# Altium schematic sheet interlock_circuit.SchDoc: foxBMS BMS-Master
size A3; DocumentNumber: 15; SheetNumber: 15; SheetTotal: 24; Author: Fraunhofer IISB foxBMS Team; REL-DATE: 2017-05-16; VERSION: 1.0.2; SheetDescription: Interlock Circuit
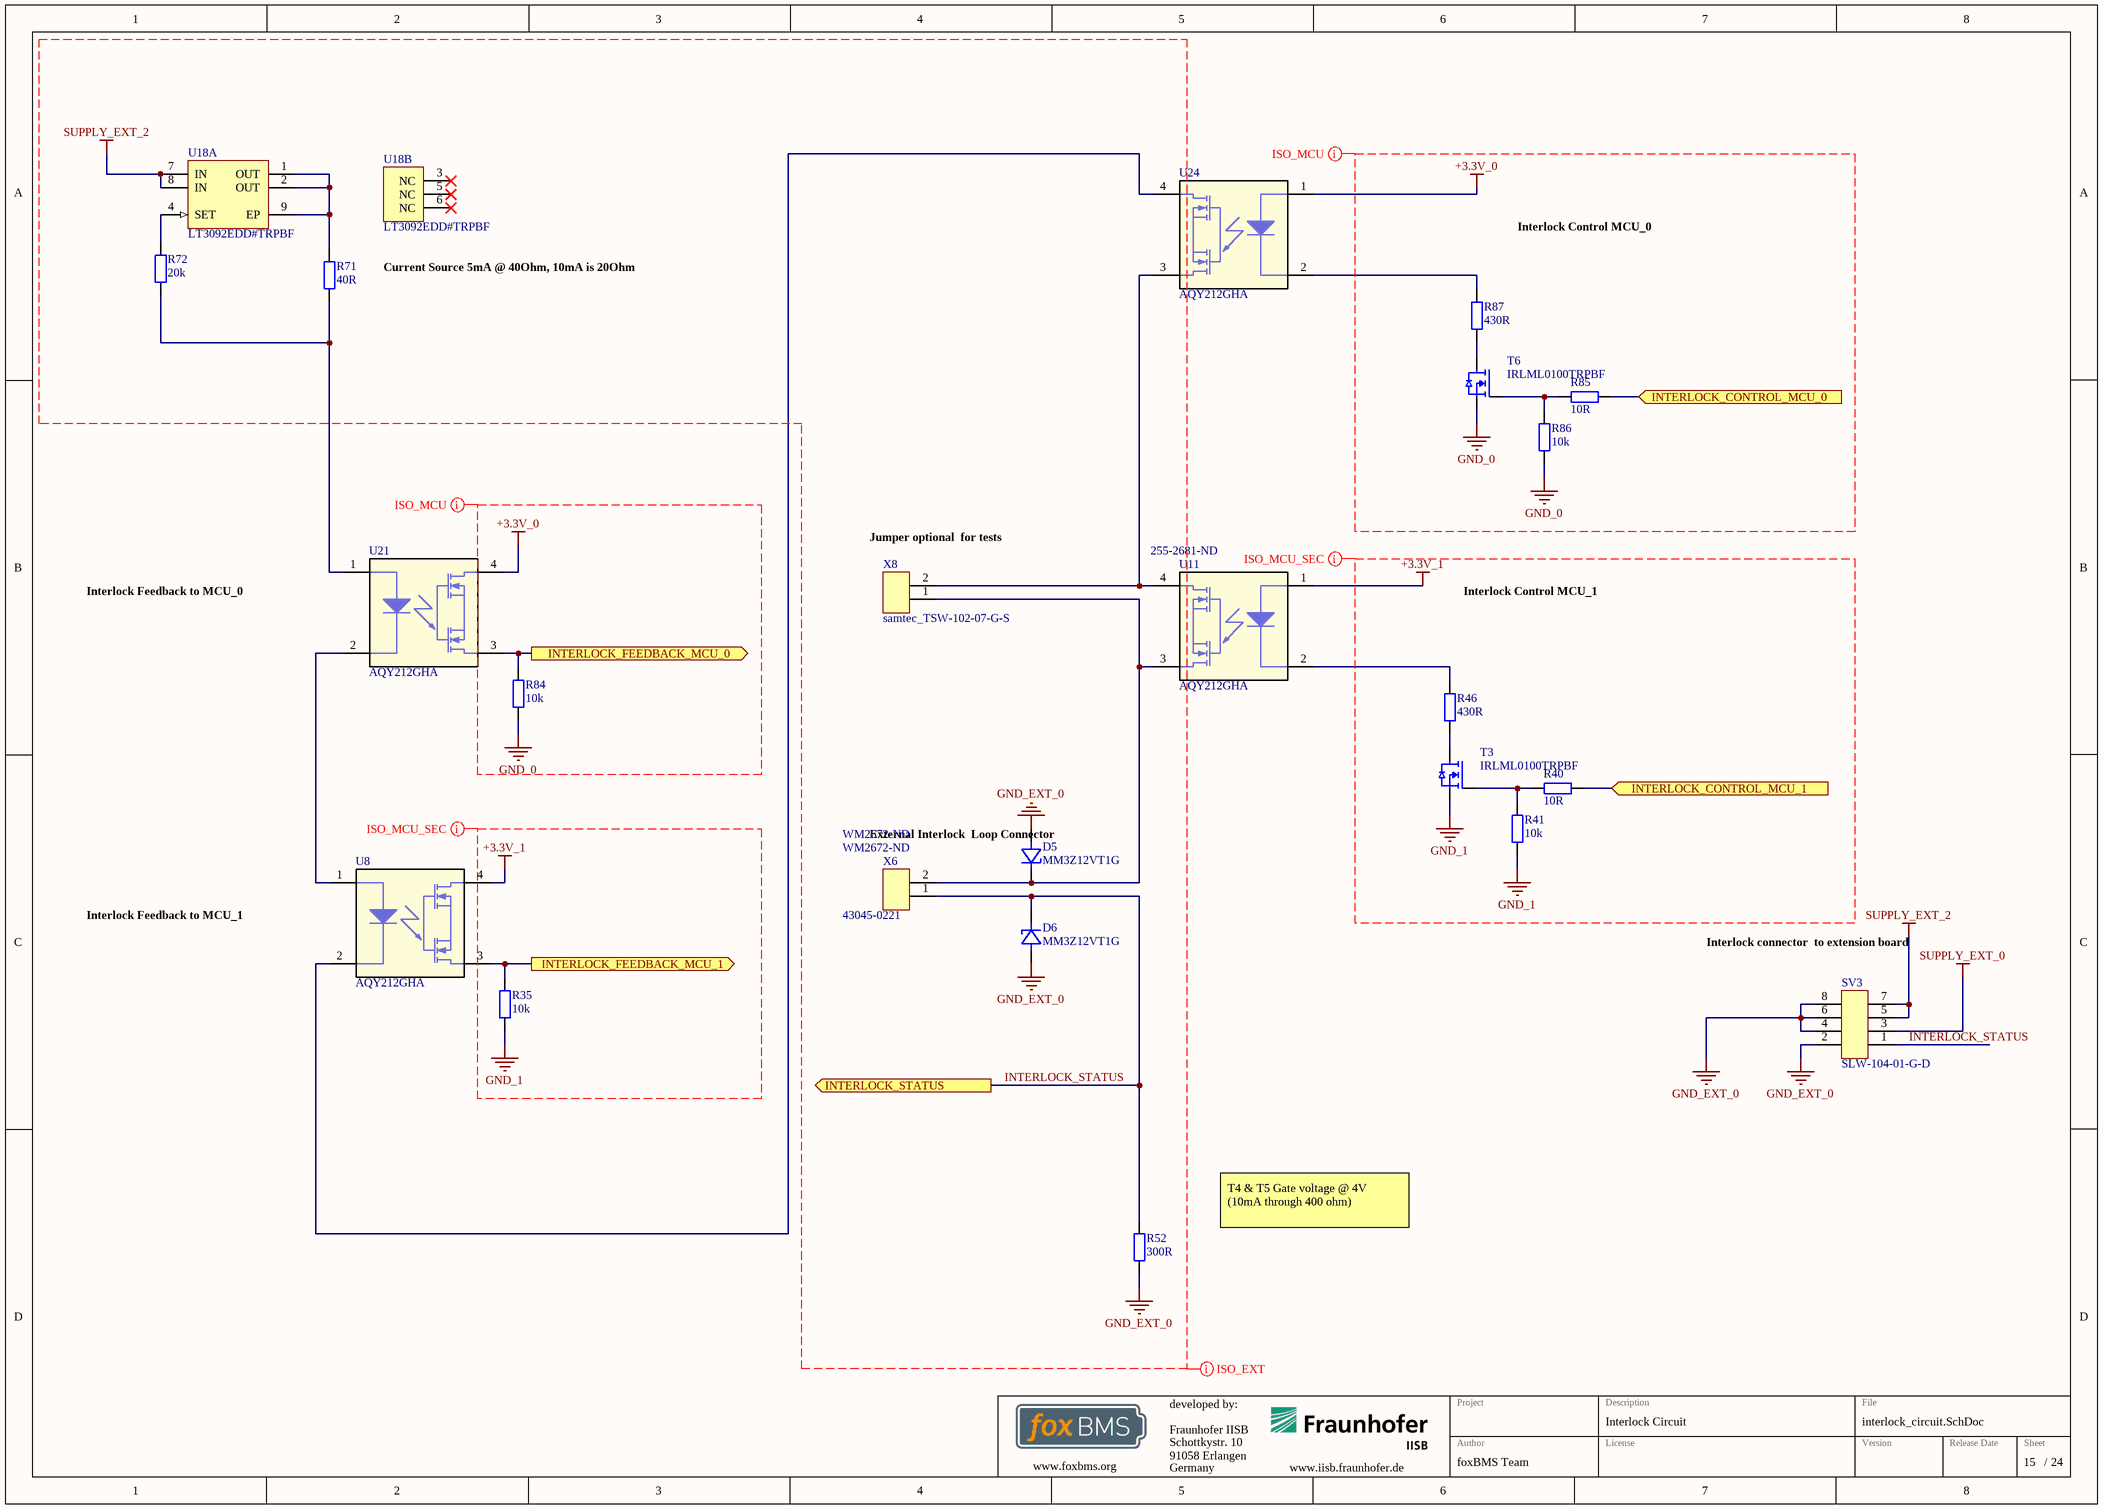
[diagram p0: interlock_circuit.SchDoc]

## Parts
D5  MM3Z12VT1G  [SODFL250X110-2N]
D6  MM3Z12VT1G  [SODFL250X110-2N]
R35  10k  [0603R]
R40  10R  [0603R]
R41  10k  [0603R]
R46  430R  [0603R]
R52  300R  [0805R]
R71  40R  [0805R]
R72  20k  [0805R]
R84  10k  [0603R]
R85  10R  [0603R]
R86  10k  [0603R]
R87  430R  [0603R]
SV3  SLW-104-01-G-D  [SLW_104_01_G_D]
T3  IRLML0100TRPBF  [SOT95P237X110-3N]
T6  IRLML0100TRPBF  [SOT95P237X110-3N]
U8  AQY212GHA  [PAN_AQY21-SO4]
U11  AQY212GHA  Supplier Part Number 1: 255-2681-ND  [PAN_AQY21-SO4]
U18  LT3092EDD#TRPBF  [LT-DD-8_V]  (parts A,B of 2)
U21  AQY212GHA  [PAN_AQY21-SO4]
U24  AQY212GHA  [PAN_AQY21-SO4]
X6  43045-0221  Supplier Part Number 1: WM2672-ND  [43045-0221]
X8  samtec_TSW-102-07-G-S  [Pinheader_2.54_2]

## Ports
INTERLOCK_CONTROL_MCU_0 (in), INTERLOCK_CONTROL_MCU_1 (in), INTERLOCK_FEEDBACK_MCU_0 (out), INTERLOCK_FEEDBACK_MCU_1 (out), INTERLOCK_STATUS (out)

## Nets
+3.3V_0: U21.4 U24.1
+3.3V_1: U8.4 U11.1
GND_0: R84.1 R86.2 T6.S
GND_1: R35.1 R41.2 T3.S
GND_EXT_0: D5.2(A) D6.2(A) R52.1 SV3.2 SV3.4 SV3.6 SV3.8
SUPPLY_EXT_0: SV3.3
SUPPLY_EXT_2: SV3.5 SV3.7 U18.7(IN) U18.8(IN)
INTERLOCK_CONTROL_MCU_0: R85.2 ; port INTERLOCK_CONTROL_MCU_0
INTERLOCK_CONTROL_MCU_1: R40.2 ; port INTERLOCK_CONTROL_MCU_1
INTERLOCK_FEEDBACK_MCU_0: R84.2 U21.3 ; port INTERLOCK_FEEDBACK_MCU_0
INTERLOCK_FEEDBACK_MCU_1: R35.2 U8.3 ; port INTERLOCK_FEEDBACK_MCU_1
INTERLOCK_STATUS: D6.1(K) R52.2 SV3.1 X6.1 ; port INTERLOCK_STATUS
NetD5_1: D5.1(K) U11.3 X6.2 X8.1
NetR40_1: R40.1 R41.1 T3.G
NetR46_1: R46.1 T3.D
NetR46_2: R46.2 U11.2
NetR71_1: R71.1 R72.1 U21.1
NetR71_2: R71.2 U18.1(OUT) U18.2(OUT) U18.9(EP)
NetR72_2: R72.2 U18.4(SET)
NetR85_1: R85.1 R86.1 T6.G
NetR87_1: R87.1 T6.D
NetR87_2: R87.2 U24.2
NetU8_1: U8.1 U21.2
NetU8_2: U8.2 U24.4
NetU11_4: U11.4 U24.3 X8.2

Not connected (* = marked no-connect by the designer): U18 3(NC)* 5(NC)* 6(NC)*

## Layout directives
net class ISO_MCU: +3.3V_0, GND_0
net class ISO_MCU_SEC: +3.3V_1, GND_1
net class ISO_EXT: GND_EXT_0, INTERLOCK_STATUS, SUPPLY_EXT_2

## Notes on the sheet
- Interlock Control MCU_0
- Current Source 5mA @ 40Ohm, 10mA is 20Ohm
- (near X8) Jumper optional
  for tests
- Interlock Feedback to MCU_0
- Interlock Control MCU_1
- (near D5) External Interlock
  Loop Connector
- Interlock Feedback to MCU_1
- Interlock connector
  to extension board
- T4 & T5 Gate voltage @ 4V (10mA through 400 ohm)
- Fraunhofer IISB
- Schottkystr. 10
- developed by:
- 91058 Erlangen
- Germany
- Author
- Project
- License
- Description
- File
- Version
- Release Date
- Sheet
- www.foxbms.org
- www.iisb.fraunhofer.de
- foxBMS Team
- /

## Library data of the parts
D5 D6 = MM3Z12VT1G: Zener Diode; Manufacturer: ON Semiconductor; Breakdown Voltage: 12V; PnP Package: SOD323; Automotive Qualified: True; Part Number: MM3Z12VT1G; Part Name: MM3Z12VT1G; Operating Temperature: *; Continuous Forward Current: *; ComponentLink1Description: Datasheet; ComponentLink1URL: http://www.farnell.com/datasheets/1876691.pdf; Supplier 1: Farnell; Supplier Part Number 1: 1431191; Supplier 2: Digikey; Supplier Part Number 2: MM3Z12VT1GOSCT-ND; Supplier 3: Mouser; Supplier Part Number 3: 863-MM3Z12VT1G
R35 R41 R84 R86 = gen_R_10k_0603: SMD Resistor 10k 0603; Tolerance: 1%; Power: 0.1W; Case EIA: 0603; Case Metric: 1608; Maximum Working Voltage: 75V; PnP Package: R_0603; Automotive Qualified: False; Part Number: gen_R_10k_0603; Operating Temperature: -55°C - +155°C; Resistance: 10k; Series: E24, E96; PnP Value: 10k; Supplier 1: Farnell; Supplier Part Number 1: 2073349
R40 R85 = gen_R_10R_0603: SMD Resistor 10R 0603; Tolerance: 1%; Power: 0.1W; Case EIA: 0603; Case Metric: 1608; Maximum Working Voltage: 75V; PnP Package: R_0603; Automotive Qualified: False; Part Number: gen_R_10R_0603; Operating Temperature: -55°C - +155°C; Resistance: 10R; Series: E24, E96; PnP Value: 10R; Supplier 1: Farnell; Supplier Part Number 1: 2073361
R46 R87 = gen_R_430R_0603: SMD Resistor 430R 0603; Tolerance: 1%; Power: 0.1W; Case EIA: 0603; Case Metric: 1608; Maximum Working Voltage: 75V; PnP Package: R_0603; Automotive Qualified: False; Part Number: gen_R_430R_0603; Operating Temperature: -55°C - +155°C; Resistance: 430R; Series: E24; PnP Value: 430R; Supplier 1: Farnell; Supplier Part Number 1: 2074259
R52 = gen_R_330R_0603: SMD Resistor 330R 0603; Part Number: gen_R_300R_0805; Power: 0.1W; Case EIA: 0805; Case Metric: 2012; Maximum Working Voltage: 75V; PnP Package: R_0603; Automotive Qualified: False; Operating Temperature: -55°C - +155°C; Resistance: 300R; Series: E24; PnP Value: 300R
R71 R72 = gen_R_120R_0603: SMD Resistor 120R 0603; Tolerance: 1%; Power: 0.1W; Case EIA: 0805; Case Metric: 2012; Maximum Working Voltage: 75V; PnP Package: R_0603; Automotive Qualified: False; Part Number: gen_R_120R_0603; Operating Temperature: -55°C - +155°C; Series: E24; PnP Value: 120R; Supplier 1: Farnell; Supplier Part Number 1: 2073369
  R71: Resistance: 40R
  R72: Resistance: 20k
SV3 = samtec_SLW-104-01-G-D: Board-To-Board Connector, Dual, 2.54 mm, 8 Contacts, Receptacle, SLW Series, Through Hole, 2 Rows; Manufacturer: Samtec; Circuits: 8; Rated Voltage: 406VAC Voltage rating; Rated Current: 5.2A; Automotive Qualified: False; Part Number: SLW-104-01-G-D; Part Name: SLW-104-01-G-D; Operating Temperature: -55°C - +125°C; ComponentLink1Description: Datasheet; ComponentLink1URL: http://www.farnell.com/datasheets/1927699.pdf; Supplier 1: Farnell; Supplier Part Number 1: 1668094; System: Connector
T3 T6 = IRLML0100TRPBF: MOSFET-Transistor, n-Kanal, 1.6 A, 100 V, 0.178 ohm, 10 V, 2.5 V; Manufacturer: Infineon; Maximum Drain-Source Voltage: 100V; Maximum Continous Drain Current (25°C): 1.6A; R_DS(on): 190m; Total Gate Charge: 2.5nC; Automotive Qualified: False; Part Number: IRLML0100TRPBF; Part Name: NMOS; Operating Temperature: -55°C - +150°C; ComponentLink1Description: Datasheet URL; ComponentLink1URL: http://www.farnell.com/datasheets/491501.pdf; Supplier 1: Farnell; Supplier Part Number 1: 1783928
U8 U11 U21 U24 = AQY212GHA: PhotoMOS GU 1 Form A, 60 V Load Voltage, 1.1 A Continuous Load Current, -40 to 85 degC, 4-Pin DIP(SMT), Tube, RoHS; Manufacturer: Panasonic; Pb-Free: True; Load Voltage: 60 V; Continuous Load Current: 1.1 A; On Resistance (Typ): 0.34 Ohm; ComponentLink1Description: Manufacturer URL; ComponentLink2Description: Datasheet; ComponentLink3Description: Package Specification; Series: PhotoMOS GU 1 Form A; ComponentLink3URL: http://www3.panasonic.biz/ac/e_download/control/relay/photomos/catalog/semi_eng_dimensions.pdf?f_cd=401560; DatasheetVersion: 201404-T; ComponentLink1URL: http://www3.panasonic.biz/ac/ae/index.jsp; Mounting Technology: Surface Mount; Packing: Tube; PackageVersion: ASCTB67E, 04/2014; PartNumber: AQY212GHA; PackageDescription: 4-Pin Surface Mount Terminal Package, Body 4.78 x 6.4 mm, Pitch 2.54mm; ComponentLink2URL: http://www3.panasonic.biz/ac/e_download/control/relay/photomos/catalog/semi_eng_gu1a_aqy21_g.pdf; RoHS: True; PackageReference: DIP4(SMT); Part Number: AQY212GHA
  U11: Supplier 1: Digi-Key
U18 = CMP-0472-00014-1: 200 mA Two-Terminal Programmable Current Source, 0.3 mA Isupply, 8-pin SON (DD-8), -40 to 125 degC, Pb-Free, Tape and Reel; Manufacturer: Linear Technology; Extended Temp: E, I, MP; Initial Accuracy(%): 1; Output Current Range: 0.5 mA to 200 mA; Vin Max(V): 40; Vin Min(V): 1.2; Isupply(mA): 0.3; DatasheetVersion: Rev. B; PackageDescription: 8-Pin Plastic DFN, Body 3 x 3 mm, Pitch 0.5 mm; ComponentLink2Description: Datasheet; ComponentLink1URL: http://www.linear.com/; Code_JEDEC: MO-229; ComponentLink2URL: http://cds.linear.com/docs/en/datasheet/3092fb.pdf; Mounting Technology: Surface Mount; ComponentLink1Description: Manufacturer URL; ComponentLink3Description: Package Specification; Packing: Tape and Reel; PackageReference: DD-8; ComponentLink3URL: http://cds.linear.com/docs/en/packaging/DFN_8_05-08-1698.pdf; PartNumber: LT3092EDD#TRPBF; RoHS: TRUE; PackageVersion: Jun-10; PartId: 1
X6 = molex_microfit_3_01x2_THT: Micro-Fit 3.0 Right Angle Header, 3.00mm Pitch, Dual Row, 2 Circuits, with Snap-in Plastic Peg PCB Lock, Tin, Glow Wire Capable, Black, 43045-0200; Manufacturer: Molex; Circuits: 2; Rated Voltage: 600V; Rated Current: 8.5A; Automotive Qualified: False; Part Number: molex_microfit_3_01x2_THT; Part Name: MicroFit; Operating Temperature: -40°C - +105°C; Supplier 1: Digi-Key; Supplier 2: Digi-Key; Supplier Part Number 2: WM2672-ND
X8 = samtec_TSW-102-07-G-S: Board-To-Board Connector, Vertical, 2.54 mm, 2 Contacts, Header, TSW Series, Through Hole, 1 Row; Manufacturer: Samtec; Circuits: 2; Automotive Qualified: False; Part Number: samtec_TSW-102-07-G-S; Part Name: TSW-102-07-G-S; Operating Temperature: -55°C - +125°C; ComponentLink1Description: Datasheet; ComponentLink1URL: http://www.farnell.com/datasheets/1796313.pdf; Supplier 1: Farnell; Supplier Part Number 1: 2505044